# EAGLE design head (EAGLE 9.6.2)
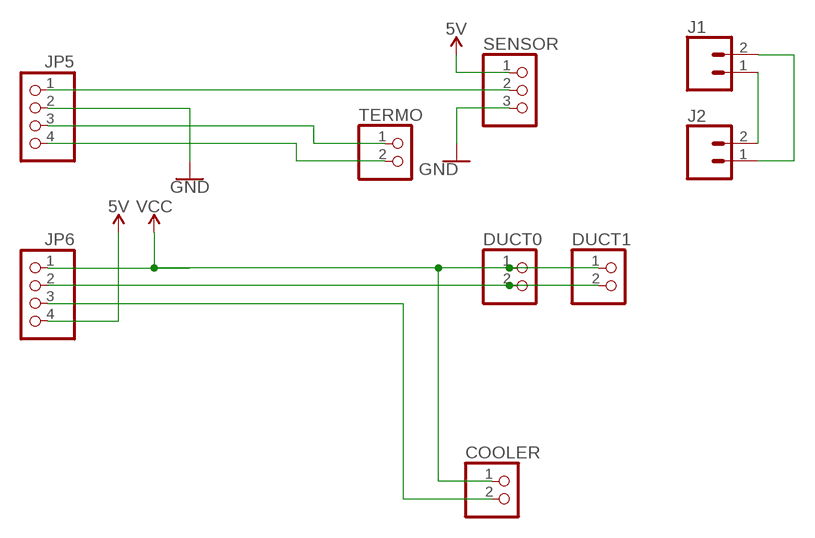
[diagram p0: schematic, sheet 1]

## Parts
COOLER  PINHD-1X2  [1X02]
DUCT0  PINHD-1X2  [1X02]
DUCT1  PINHD-1X2  [1X02]
J1  CONN_025MM  [SCREWTERMINAL-5MM-2]
J2  CONN_025MM  [SCREWTERMINAL-5MM-2]
JP5  PINHD-1X4  [1X04]
JP6  PINHD-1X4  [1X04]
SENSOR  PINHD-1X3  [1X03]
TERMO  PINHD-1X2  [1X02]

## Nets
5V: JP6.4 SENSOR.1
GND: JP5.2 SENSOR.3
N$1: JP5.1 SENSOR.2
N$2: COOLER.2 JP6.3
N$3: JP5.3 TERMO.1
N$4: J1.1 J2.2
N$5: JP5.4 TERMO.2
N$6: J1.2 J2.1
N$9: DUCT0.2 DUCT1.2 JP6.2
VCC: COOLER.1 DUCT0.1 DUCT1.1 JP6.1

## Library data of the parts
COOLER DUCT0 DUCT1 TERMO = pinhead:PINHD-1X2: PIN HEADER
J1 J2 = SparkFun-Connectors:CONN_02: Multi connection point. Often used as Generic Header-pin footprint for 0.1 inch spaced/style header connections On any of the 0.1 inch spaced packages, you can populate with these: Break Away Headers - Straight <https://www.sparkfun.com/products/116> (PRT-00116) Break Away Male Headers - Right Angle <https://www.sparkfun.com/products/553> (PRT-00553) Female Headers <https://www.sparkfun.com/products/115> (PRT-00115) Break Away Headers - Machine Pin <https://www.sparkfun.com/products/117> (PRT-00117) Break Away Female Headers - Swiss Machine Pin <https://www.sparkfun.com/products/743> (PRT-00743) For SCREWTERMINALS and SPRING TERMINALS visit here: Screw Terimnals on SparkFun.com <https://www.sparkfun.com/search/results?term=Screw+Terminals> (5mm/3.5mm/2.54mm spacing) This device is also useful as a general connection point to wire up your design to another part of your project. Our various solder wires solder well into these plated through hole pads. Hook-Up Wire - Assortment (Stranded, 22 AWG) <https://www.sparkfun.com/products/11375> (PRT-11375) Hook-Up Wire - Assortment (Solid Core, 22 AWG) <https://www.sparkfun.com/products/11367> (PRT-11367) View the entire wire category on our website here <https://www.sparkfun.com/categories/141> Special notes: Molex polarized connector foot print use with: PRT-08233 with associated crimp pins and housings. 2.54_SCREWTERM for use with PRT-10571. 3.5mm Screw Terminal footprints for PRT-08084 5mm Screw Terminal footprints for use with PRT-08432; SF_SKU: PRT-08432
JP5 JP6 = pinhead:PINHD-1X4: PIN HEADER
SENSOR = pinhead:PINHD-1X3: PIN HEADER

## Board
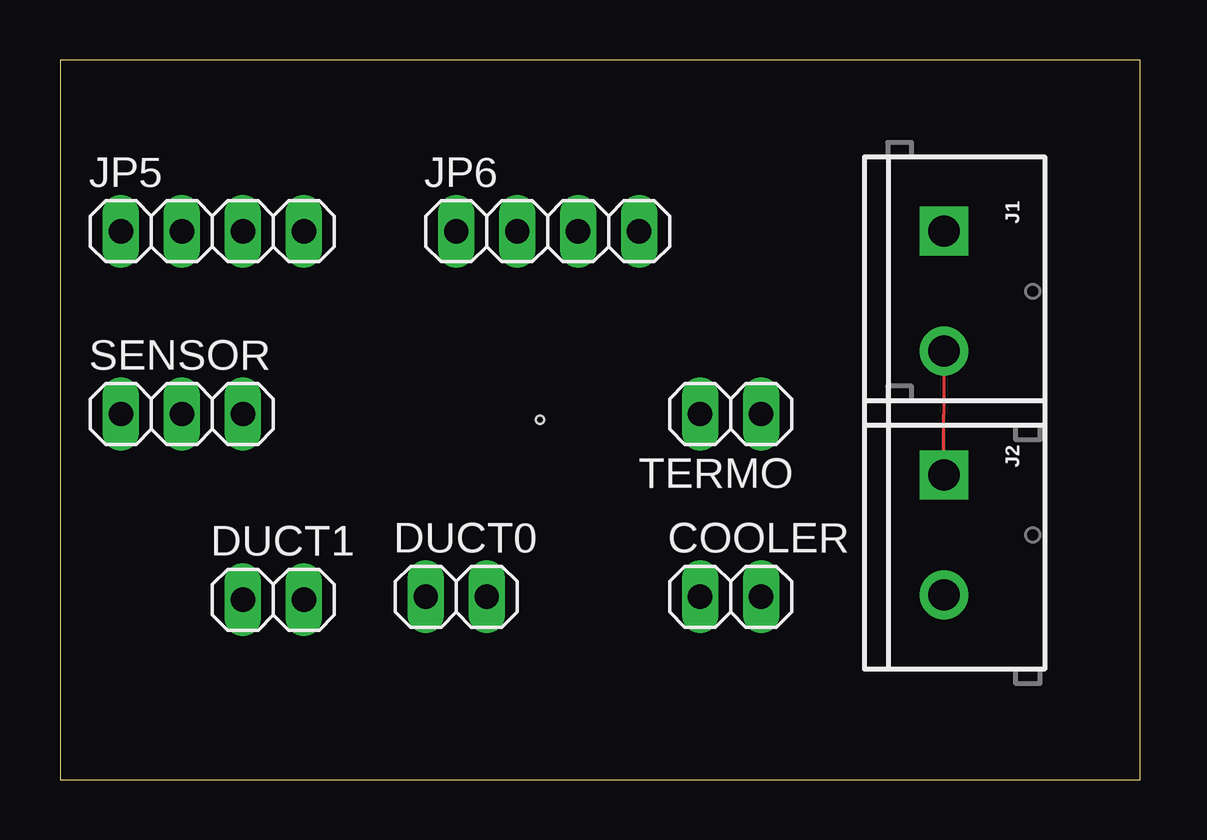
[diagram p1: board, top side]
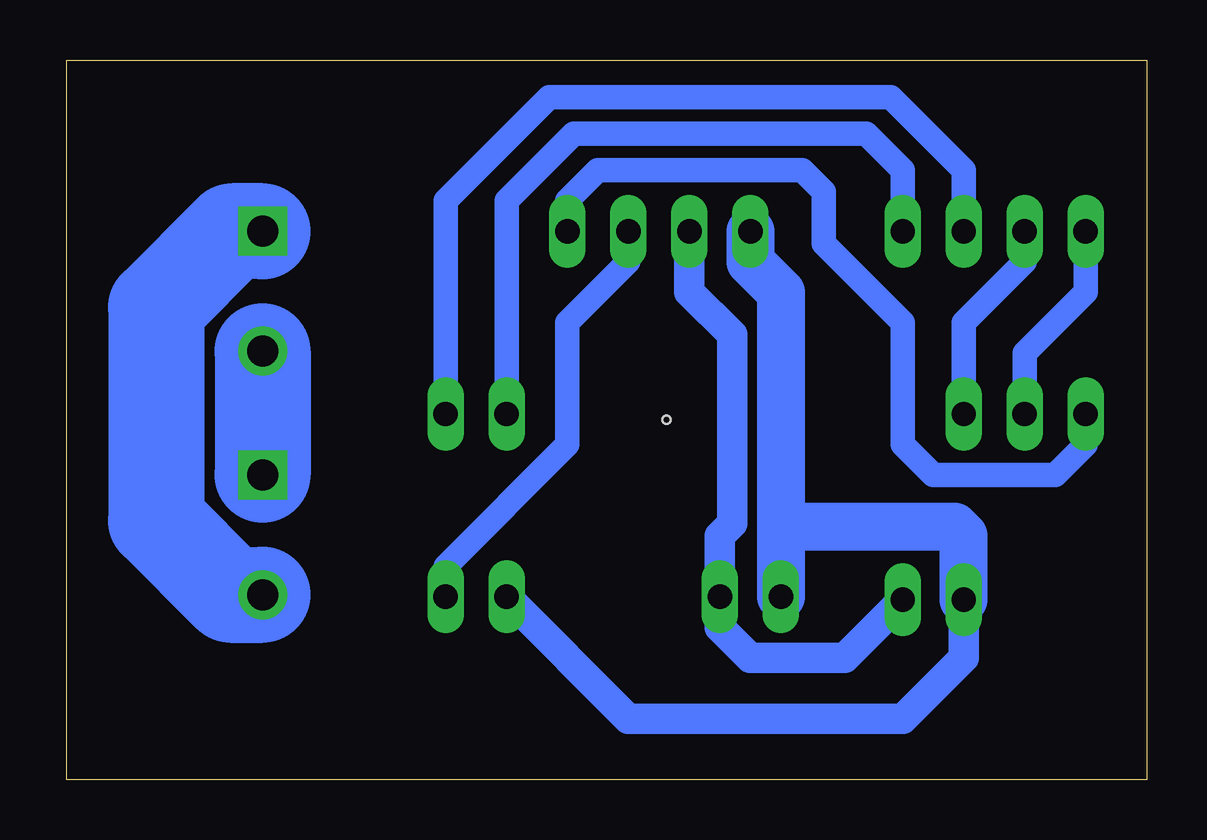
[diagram p2: board, bottom side, seen from below]

Size 45 x 30 mm. Coordinates in mm from the lower left corner, seen from the top.
Outline: 0,0 45,0 45,30 0,30 0,0
Copper layers (1*16): Top 0.035mm / dielectric 1.5mm / Bottom 0.035mm
Design rules "default": minimum track width 6mil, minimum drill 0.35mm, track to track 6mil, track to pad 6mil, pad to pad 6mil, via to via 6mil, smd to smd 6mil, copper to edge 40mil, drill to drill 6mil, minimum pad ring 10mil, minimum via ring 8mil, stop-mask expansion 4mil, vias tented up to drill 0mil, thermal gap 10mil
Holes 0.35 mm at 20,15

### Footprints (pad centres in the part's own frame; a part is rotated, then mirrored left to right if it is on the bottom)
1X02 = drill 1.016 long: 1 -1.27,0; 2 1.27,0
SCREWTERMINAL-5MM-2 = drill 1.3 pad 2.032 square: 1 0,0 | drill 1.3 pad 2.032: 2 5,0
1X04 = drill 1.016 long: 1 -3.81,0; 2 -1.27,0; 3 1.27,0; 4 3.81,0
1X03 = drill 1.016 long: 1 -2.54,0; 2 0,0; 3 2.54,0

### Placement (x,y rotation side)
COOLER  27.94,7.62 0 top
DUCT0  16.51,7.62 0 top
DUCT1  8.89,7.49 0 top
J1  36.83,22.86 270 top
J2  36.83,12.7 270 top
JP5  6.35,22.86 0 top
JP6  20.32,22.86 0 top
SENSOR  5.08,15.24 0 top
TERMO  27.94,15.24 180 top

### Tracks (layer width: path | path; a pad name or v marks a point on that pad's centre or on a via)
5V
  Bottom 1.016: SENSOR.1 2.54,13.97 3.81,12.7 8.89,12.7 10.16,13.97 10.16,19.05 13.46,22.35 13.46,24.51 14.35,25.4 22.86,25.4 24.13,24.13 JP6.4
GND
  Bottom 1.016: JP5.2 5.08,21.59 7.62,19.05 SENSOR.3
N$1
  Bottom 1.016: JP5.1 2.54,20.32 5.08,17.78 SENSOR.2
N$2
  Bottom 1.016: COOLER.2 29.21,8.89 24.13,13.97 24.13,19.05 21.59,21.59 JP6.3
N$3
  Bottom 1.016: JP5.3 7.62,25.4 10.67,28.45 24.89,28.45 29.21,24.13 TERMO.1
N$4
  Bottom 4: J1.1 38.1,22.86 41.27,19.68 41.27,10.79 38.18,7.7 J2.2
N$5
  Bottom 1.016: JP5.4 10.16,25.4 11.68,26.92 23.88,26.92 26.67,24.13 TERMO.2
N$6
  Bottom 4: J1.2 J2.1
N$9
  Bottom 1.27: JP6.2 19.05,20.32 17.27,18.54 17.27,10.67 17.78,10.16 DUCT0.2 17.78,6.35 16.51,5.08 12.57,5.08 DUCT1.2
VCC
  Bottom 1.27: DUCT1.1 7.62,5.08 10.16,2.54 21.59,2.54 COOLER.1
  Bottom 2: 15.24,10.16 DUCT0.1 | DUCT1.1 7.62,10.16 8,10.54 14.86,10.54 15.24,10.16 | JP6.1 16.51,21.59 15.24,20.32 15.24,10.16
(copper drawn outside any net)
  shapes: Top area x1